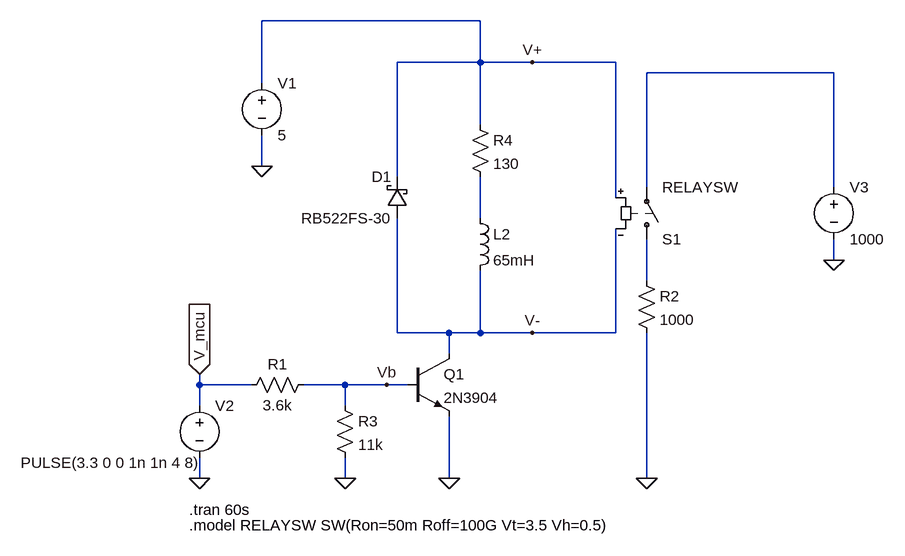
[diagram p0: schematic DO.asc]
DO.asc, the LTspice schematic file:
Version 4
SHEET 1 2520 680
WIRE 272 -384 -64 -384
WIRE 272 -320 272 -384
WIRE 272 -320 144 -320
WIRE 352 -320 272 -320
WIRE 480 -320 352 -320
WIRE 816 -304 528 -304
WIRE -64 -288 -64 -384
WIRE 272 -224 272 -320
WIRE -64 -160 -64 -208
WIRE 144 -144 144 -320
WIRE 528 -128 528 -304
WIRE 816 -128 816 -304
WIRE 480 -112 480 -320
WIRE 272 -80 272 -144
WIRE 816 -16 816 -48
WIRE 528 16 528 -48
WIRE 144 96 144 -80
WIRE 224 96 144 96
WIRE 272 96 272 0
WIRE 272 96 224 96
WIRE 352 96 272 96
WIRE 480 96 480 -64
WIRE 480 96 352 96
WIRE 224 128 224 96
WIRE -160 176 -160 160
WIRE -80 176 -160 176
WIRE 64 176 0 176
WIRE 128 176 64 176
WIRE 160 176 128 176
WIRE -160 208 -160 176
WIRE 64 208 64 176
WIRE -160 320 -160 288
WIRE 64 320 64 288
WIRE 224 320 224 224
WIRE 528 320 528 96
FLAG -64 -160 0
FLAG -160 320 0
FLAG 816 -16 0
FLAG 528 320 0
FLAG 128 176 Vb
FLAG 64 320 0
FLAG -160 160 V_mcu
IOPIN -160 160 In
FLAG 224 320 0
FLAG 352 -320 V+
FLAG 352 96 V-
SYMBOL npn 160 128 R0
SYMATTR InstName Q1
SYMATTR Value 2N3904
SYMBOL res 16 160 R90
WINDOW 0 0 56 VBottom 2
WINDOW 3 32 56 VTop 2
SYMATTR InstName R1
SYMATTR Value 3.6k
SYMBOL voltage -64 -304 R0
SYMATTR InstName V1
SYMATTR Value 5
SYMBOL voltage -160 192 R0
WINDOW 123 0 0 Left 0
WINDOW 39 0 0 Left 0
WINDOW 3 -275 104 Left 2
SYMATTR Value PULSE(3.3 0 0 1n 1n 4 8)
SYMATTR InstName V2
SYMBOL res 256 -240 R0
SYMATTR InstName R4
SYMATTR Value 130
SYMBOL ind 256 -96 R0
SYMATTR InstName L2
SYMATTR Value 65mH
SYMBOL sw 528 -32 M180
SYMATTR InstName S1
SYMATTR Value RELAYSW
SYMBOL voltage 816 -144 R0
WINDOW 123 0 0 Left 0
WINDOW 39 0 0 Left 0
SYMATTR InstName V3
SYMATTR Value 1000
SYMBOL res 512 0 R0
SYMATTR InstName R2
SYMATTR Value 1000
SYMBOL schottky 160 -80 R180
WINDOW 0 24 64 Left 2
WINDOW 3 24 0 Left 2
SYMATTR InstName D1
SYMATTR Value RB522FS-30
SYMATTR Description Diode
SYMATTR Type diode
SYMBOL res 48 192 R0
SYMATTR InstName R3
SYMATTR Value 11k
TEXT -176 368 Left 2 !.tran 60s
TEXT -176 392 Left 2 !.model RELAYSW SW(Ron=50m Roff=100G Vt=3.5 Vh=0.5)

The netlist it stands for:
* DO.asc
Q1 V- Vb 0 0 2N3904
R1 Vb V_mcu 3.6k
V1 V+ 0 5
V2 V_mcu 0 PULSE(3.3 0 0 1n 1n 4 8)
R4 V+ N002 130
L2 N002 V- 65mH
S1 N003 N001 V+ V- RELAYSW
V3 N001 0 1000
R2 N003 0 1000
D1 V- V+ RB522FS-30
R3 Vb 0 11k
.model D D
.lib standard.dio
.model NPN NPN
.model PNP PNP
.lib standard.bjt
.tran 60s
.model RELAYSW SW(Ron=50m Roff=100G Vt=3.5 Vh=0.5)
.backanno
.end